# Altium schematic sheet Filter1.SchDoc
size 420 x 297 mm; SheetNumber: 6; SheetTotal: 13
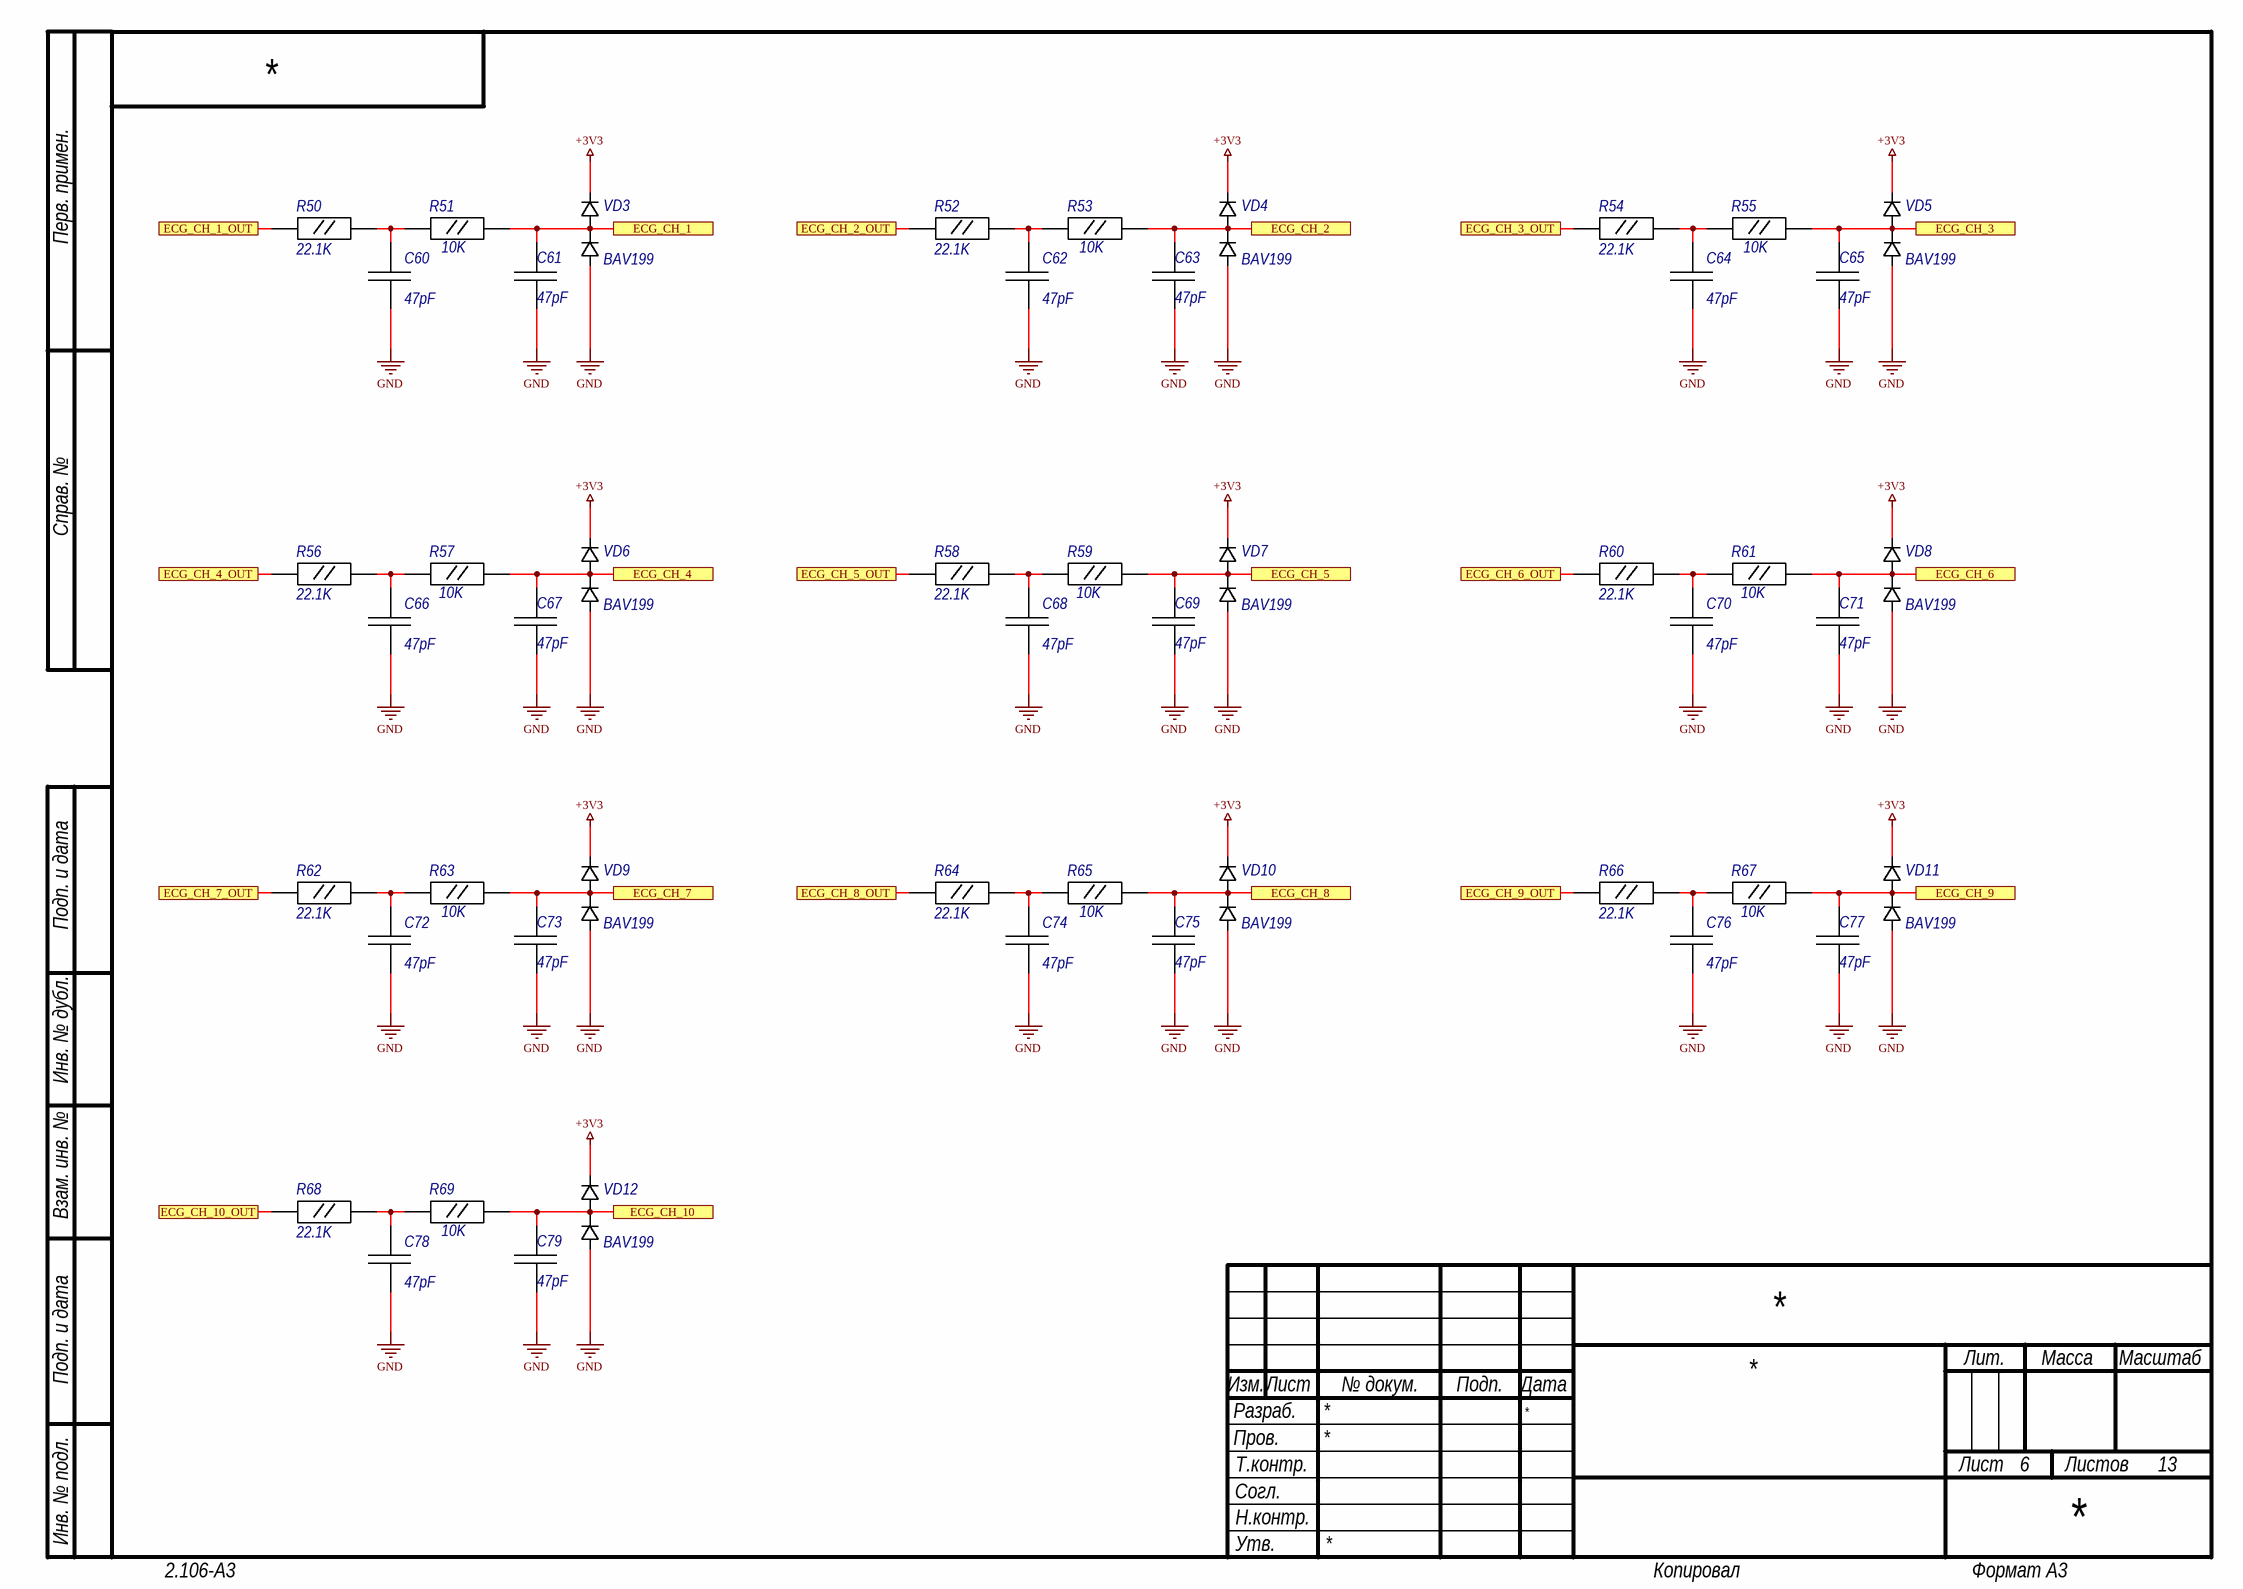
[diagram p0: Filter1.SchDoc]

## Parts
C60  47pF  [C0603]
C61  47pF  [C0603]
C62  47pF  [C0603]
C63  47pF  [C0603]
C64  47pF  [C0603]
C65  47pF  [C0603]
C66  47pF  [C0603]
C67  47pF  [C0603]
C68  47pF  [C0603]
C69  47pF  [C0603]
C70  47pF  [C0603]
C71  47pF  [C0603]
C72  47pF  [C0603]
C73  47pF  [C0603]
C74  47pF  [C0603]
C75  47pF  [C0603]
C76  47pF  [C0603]
C77  47pF  [C0603]
C78  47pF  [C0603]
C79  47pF  [C0603]
R50  22.1K  [R0603]
R51  10K  [R0603]
R52  22.1K  [R0603]
R53  10K  [R0603]
R54  22.1K  [R0603]
R55  10K  [R0603]
R56  22.1K  [R0603]
R57  10K  [R0603]
R58  22.1K  [R0603]
R59  10K  [R0603]
R60  22.1K  [R0603]
R61  10K  [R0603]
R62  22.1K  [R0603]
R63  10K  [R0603]
R64  22.1K  [R0603]
R65  10K  [R0603]
R66  22.1K  [R0603]
R67  10K  [R0603]
R68  22.1K  [R0603]
R69  10K  [R0603]
VD3  BAV199  [SOT23]
VD4  BAV199  [SOT23]
VD5  BAV199  [SOT23]
VD6  BAV199  [SOT23]
VD7  BAV199  [SOT23]
VD8  BAV199  [SOT23]
VD9  BAV199  [SOT23]
VD10  BAV199  [SOT23]
VD11  BAV199  [SOT23]
VD12  BAV199  [SOT23]

## Ports
ECG_CH_1, ECG_CH_1_OUT, ECG_CH_2, ECG_CH_2_OUT, ECG_CH_3, ECG_CH_3_OUT, ECG_CH_4, ECG_CH_4_OUT, ECG_CH_5, ECG_CH_5_OUT, ECG_CH_6, ECG_CH_6_OUT, ECG_CH_7, ECG_CH_7_OUT, ECG_CH_8, ECG_CH_8_OUT, ECG_CH_9, ECG_CH_9_OUT, ECG_CH_10, ECG_CH_10_OUT

## Nets
+3V3: VD3.2 VD4.2 VD5.2 VD6.2 VD7.2 VD8.2 VD9.2 VD10.2 VD11.2 VD12.2
GND: C60.1 C61.1 C62.1 C63.1 C64.1 C65.1 C66.1 C67.1 C68.1 C69.1 C70.1 C71.1 C72.1 C73.1 C74.1 C75.1 C76.1 C77.1 C78.1 C79.1 VD3.1 VD4.1 VD5.1 VD6.1 VD7.1 VD8.1 VD9.1 VD10.1 VD11.1 VD12.1
ECG_CH_1: C61.2 R51.2 VD3.3 ; port ECG_CH_1
ECG_CH_1_OUT: R50.1 ; port ECG_CH_1_OUT
ECG_CH_2: C63.2 R53.2 VD4.3 ; port ECG_CH_2
ECG_CH_2_OUT: R52.1 ; port ECG_CH_2_OUT
ECG_CH_3: C65.2 R55.2 VD5.3 ; port ECG_CH_3
ECG_CH_3_OUT: R54.1 ; port ECG_CH_3_OUT
ECG_CH_4: C67.2 R57.2 VD6.3 ; port ECG_CH_4
ECG_CH_4_OUT: R56.1 ; port ECG_CH_4_OUT
ECG_CH_5: C69.2 R59.2 VD7.3 ; port ECG_CH_5
ECG_CH_5_OUT: R58.1 ; port ECG_CH_5_OUT
ECG_CH_6: C71.2 R61.2 VD8.3 ; port ECG_CH_6
ECG_CH_6_OUT: R60.1 ; port ECG_CH_6_OUT
ECG_CH_7: C73.2 R63.2 VD9.3 ; port ECG_CH_7
ECG_CH_7_OUT: R62.1 ; port ECG_CH_7_OUT
ECG_CH_8: C75.2 R65.2 VD10.3 ; port ECG_CH_8
ECG_CH_8_OUT: R64.1 ; port ECG_CH_8_OUT
ECG_CH_9: C77.2 R67.2 VD11.3 ; port ECG_CH_9
ECG_CH_9_OUT: R66.1 ; port ECG_CH_9_OUT
ECG_CH_10: C79.2 R69.2 VD12.3 ; port ECG_CH_10
ECG_CH_10_OUT: R68.1 ; port ECG_CH_10_OUT
NetC60_2: C60.2 R50.2 R51.1
NetC62_2: C62.2 R52.2 R53.1
NetC64_2: C64.2 R54.2 R55.1
NetC66_2: C66.2 R56.2 R57.1
NetC68_2: C68.2 R58.2 R59.1
NetC70_2: C70.2 R60.2 R61.1
NetC72_2: C72.2 R62.2 R63.1
NetC74_2: C74.2 R64.2 R65.1
NetC76_2: C76.2 R66.2 R67.1
NetC78_2: C78.2 R68.2 R69.1

## Notes on the sheet
- Перв. примен.
- Справ. №
- Подп. и дата
- Инв. № дубл.
- Взам. инв. №
- Разраб.
- Изм.
- Лист
- № докум.
- Подп.
- Дата
- Лит.
- Масса
- Масштаб
- Пров.
- Т.контр.
- Листов
- Инв. № подл.
- Согл.
- Утв.
- Н.контр.
- 2.106-A3
- Копировал
- Формат А3

## Library data of the parts
C60-C79 = CC_SMD_0603: Ceramic Capacitor SMD; Package: 0603; Value: 47pF
R50-R69 = R0603: Resistor SMD
  R50 R52 R54 R56 R58 R60 R62 R64 R66 R68: Value: 22.1K
  R51 R53 R55 R57 R59 R61 R63 R65 R67 R69: Value: 10K
VD3-VD12 = DIODE_BAV199: Diod Schottky; Diode Type: Standard; Package: SOT-23; PartNumber: BAV199; Manufacturer Part Number 1: BAV199